# EasyEDA schematic SCH_Protection Circuit_EasyEDA.json
TITLE: Power and Protection Circuit; REV: 1.0; Date: 2021-08-24; Sheet: 1/1; Drawn By: Yaser Alshoibi; Company: Smart Methods
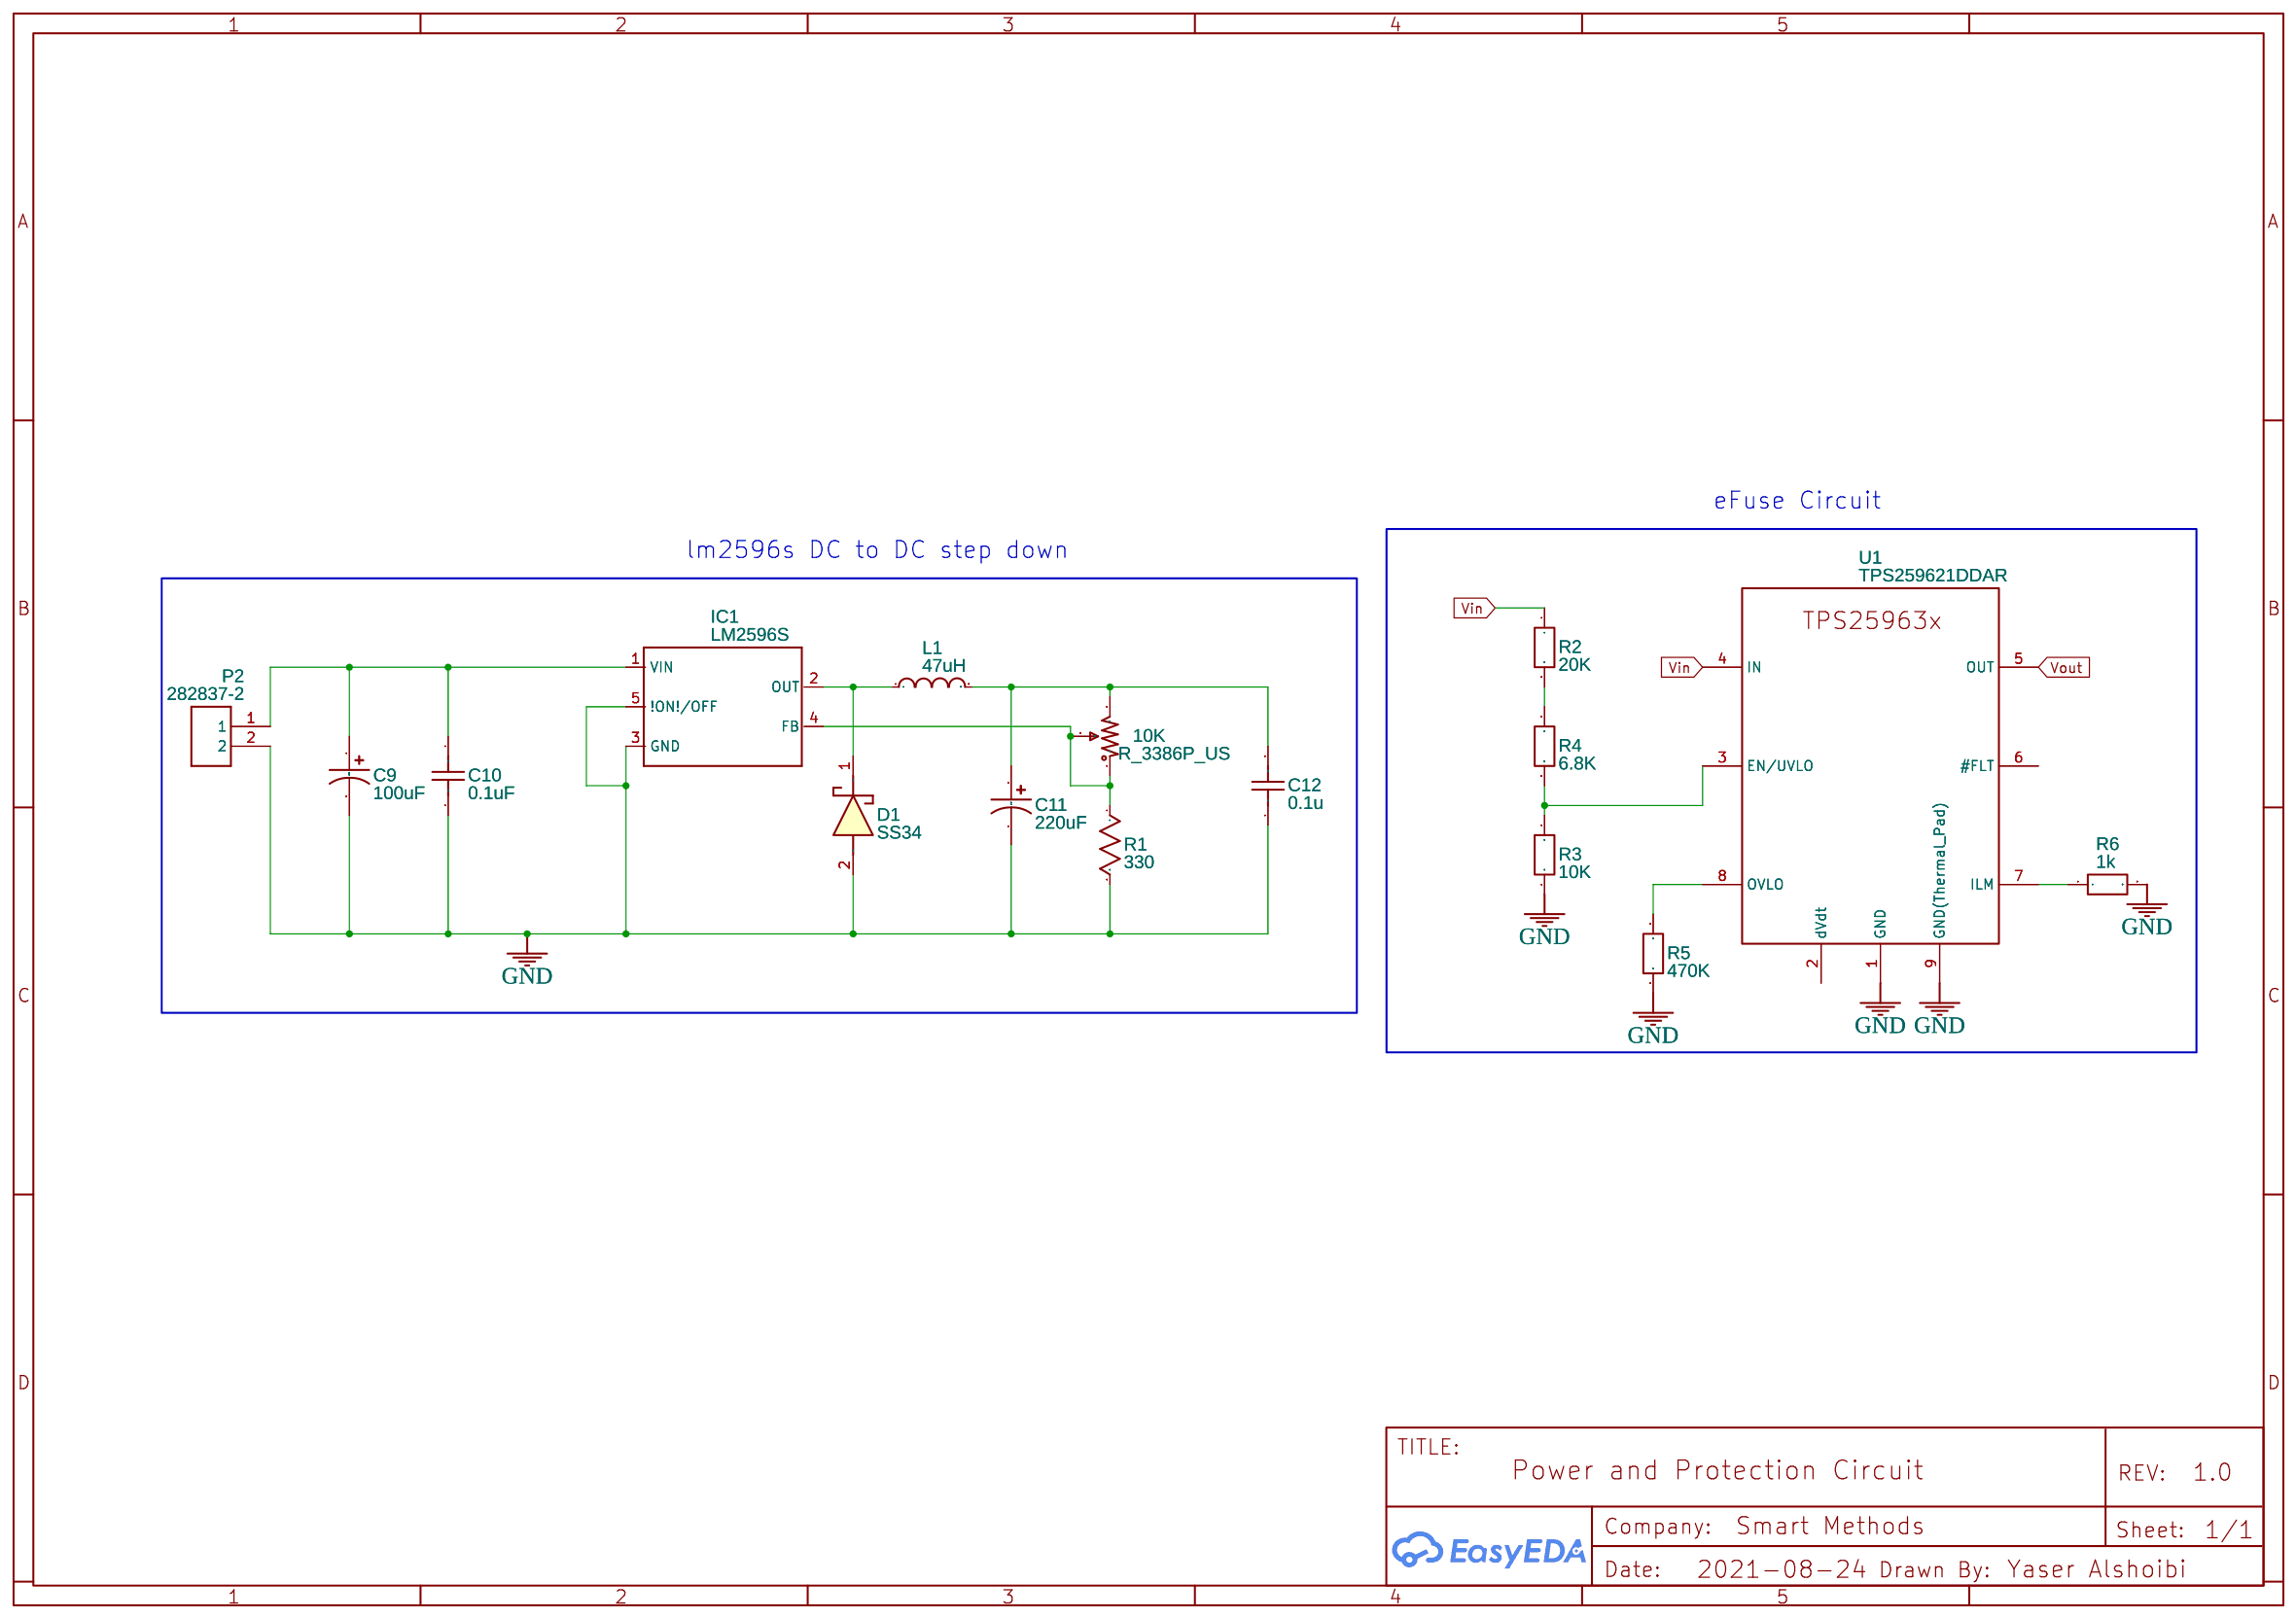
[diagram p0: schematic sheet]

## Parts
10K  R_3386P_US  [RES-ADJ-TH_3386P]
C9  100uF  [CASE-A_3216]
C10  0.1uF  [C0603]
C11  220uF  [CASE-A_3216]
C12  0.1u  [C0603]
D1  SS34  [DIOM8059X256N]
IC1  LM2596S  [TO263-5]
L1  47uH  [L0603]
P2  282837-2  [TE_282837-2]
R1  330  [R0603]
R2  20K  [R0603]
R3  10K  [R0603]
R4  6.8K  [R0603]
R5  470K  [R0603]
R6  1k  [R0603]
U1  TPS259621DDAR  [TI_SO-POWERPAD-8]

## Library data of the parts
10K = R_3386P_US: Supplier: LCSC; Contributor: LCEDA_Lib
C9 C11 = C_Tan_SMD_A_US: Contributor: LCEDA_Lib
C10 C12 = C_0603_US: Contributor: LCEDA_Lib
D1 = SS34: Contributor: larryng5613
IC1 = LM2596S: Contributor: celinasubocz
L1 = L0603_US: Contributor: LCEDA_Lib
P2 = 282837-2: Contributor: Pele Constam
R1 = R_0603_US: Contributor: LCEDA_Lib
R2-R6 = R_0603_EU: Contributor: LCEDA_Lib
U1 = TPS259621DDAR: Manufacturer: Texas Instruments; Supplier: Mouser; Supplier Part: 595-TPS259621DDAR; link: http://www.ti.com/lit/ds/symlink/tps2596.pdf; Contributor: sam123998877

## Nets
GND: C9.2 C10.2 C11.2 C12.1 D1.2(A) IC1.3(GND) IC1.5(!ON!/OFF) P2.2 R1.2 R3.2 R5.1 R6.2 U1.1(GND) U1.9(GND(Thermal Pad))
Vin: R2.1 U1.4(IN)
Vout: U1.5(OUT)
Net-(10K-1): 10K.1 10K.2 IC1.4(FB) R1.1
Net-(10K-3): 10K.3 C11.1 C12.2 L1.2
Net-(C9-1): C9.1 C10.1 IC1.1(VIN) P2.1
Net-(D1-1): D1.1(K) IC1.2(OUT) L1.1
Net-(R2-2): R2.2 R4.1
Net-(R3-1): R3.1 R4.2 U1.3(EN/UVLO)
Net-(R5-2): R5.2 U1.8(OVLO)
Net-(R6-1): R6.1 U1.7(ILM)

Not connected (* = marked no-connect by the designer): U1 2(dVdt) 6(#FLT)

## Notes on the sheet
- eFuse Circuit
- lm2596s DC to DC step down
